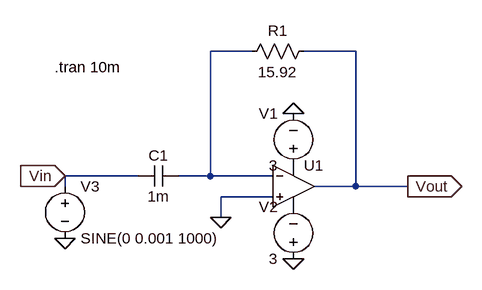
[diagram p0: schematic differentiator_sine.asc]
differentiator_sine.asc, the LTspice schematic file:
Version 4
SHEET 1 880 680
WIRE 64 -112 0 -112
WIRE 224 -112 144 -112
WIRE -112 80 -224 80
WIRE 0 80 0 -112
WIRE 0 80 -48 80
WIRE 96 80 0 80
WIRE -224 96 -224 80
WIRE 224 96 224 -112
WIRE 224 96 160 96
WIRE 304 96 224 96
WIRE 96 112 16 112
WIRE 16 144 16 112
FLAG 128 208 0
FLAG 128 -16 0
FLAG -224 176 0
FLAG 16 144 0
FLAG 304 96 Vout
IOPIN 304 96 Out
FLAG -224 80 Vin
IOPIN -224 80 In
SYMBOL OpAmps\\UniversalOpamp2 128 96 R0
SYMATTR InstName U1
SYMATTR Value2 Avol=1Meg GBW=100000Meg Slew=10Meg
SYMBOL voltage 128 80 R180
WINDOW 0 24 96 Left 2
WINDOW 3 24 16 Left 2
WINDOW 123 0 0 Left 0
WINDOW 39 0 0 Left 0
SYMATTR InstName V1
SYMATTR Value 3
SYMBOL voltage 128 224 R180
WINDOW 0 24 96 Left 2
WINDOW 3 24 16 Left 2
WINDOW 123 0 0 Left 0
WINDOW 39 0 0 Left 0
SYMATTR InstName V2
SYMATTR Value 3
SYMBOL voltage -224 80 R0
WINDOW 123 0 0 Left 0
WINDOW 39 0 0 Left 0
SYMATTR InstName V3
SYMATTR Value SINE(0 0.001 1000)
SYMBOL cap -48 64 R90
WINDOW 0 0 32 VBottom 2
WINDOW 3 32 32 VTop 2
SYMATTR InstName C1
SYMATTR Value 1m
SYMBOL res 160 -128 R90
WINDOW 0 0 56 VBottom 2
WINDOW 3 32 56 VTop 2
SYMATTR InstName R1
SYMATTR Value 15.92
TEXT -240 -88 Left 2 !.tran 10m

The netlist it stands for:
* differentiator_sine.asc
XU1 0 N001 P001 P002 Vout level.2 Avol=1Meg GBW=100000Meg Slew=10Meg ilimit=25m rail=0 Vos=0 phimargin=45 en=0 enk=0 in=0 ink=0 Rin=500Meg  ; pins IN+ IN- V+ V- OUT
V1 P001 0 3
V2 0 P002 3
V3 Vin 0 SINE(0 0.001 1000)
C1 N001 Vin 1m
R1 Vout N001 15.92
.tran 10m
.lib UniversalOpamps2.sub
.backanno
.end